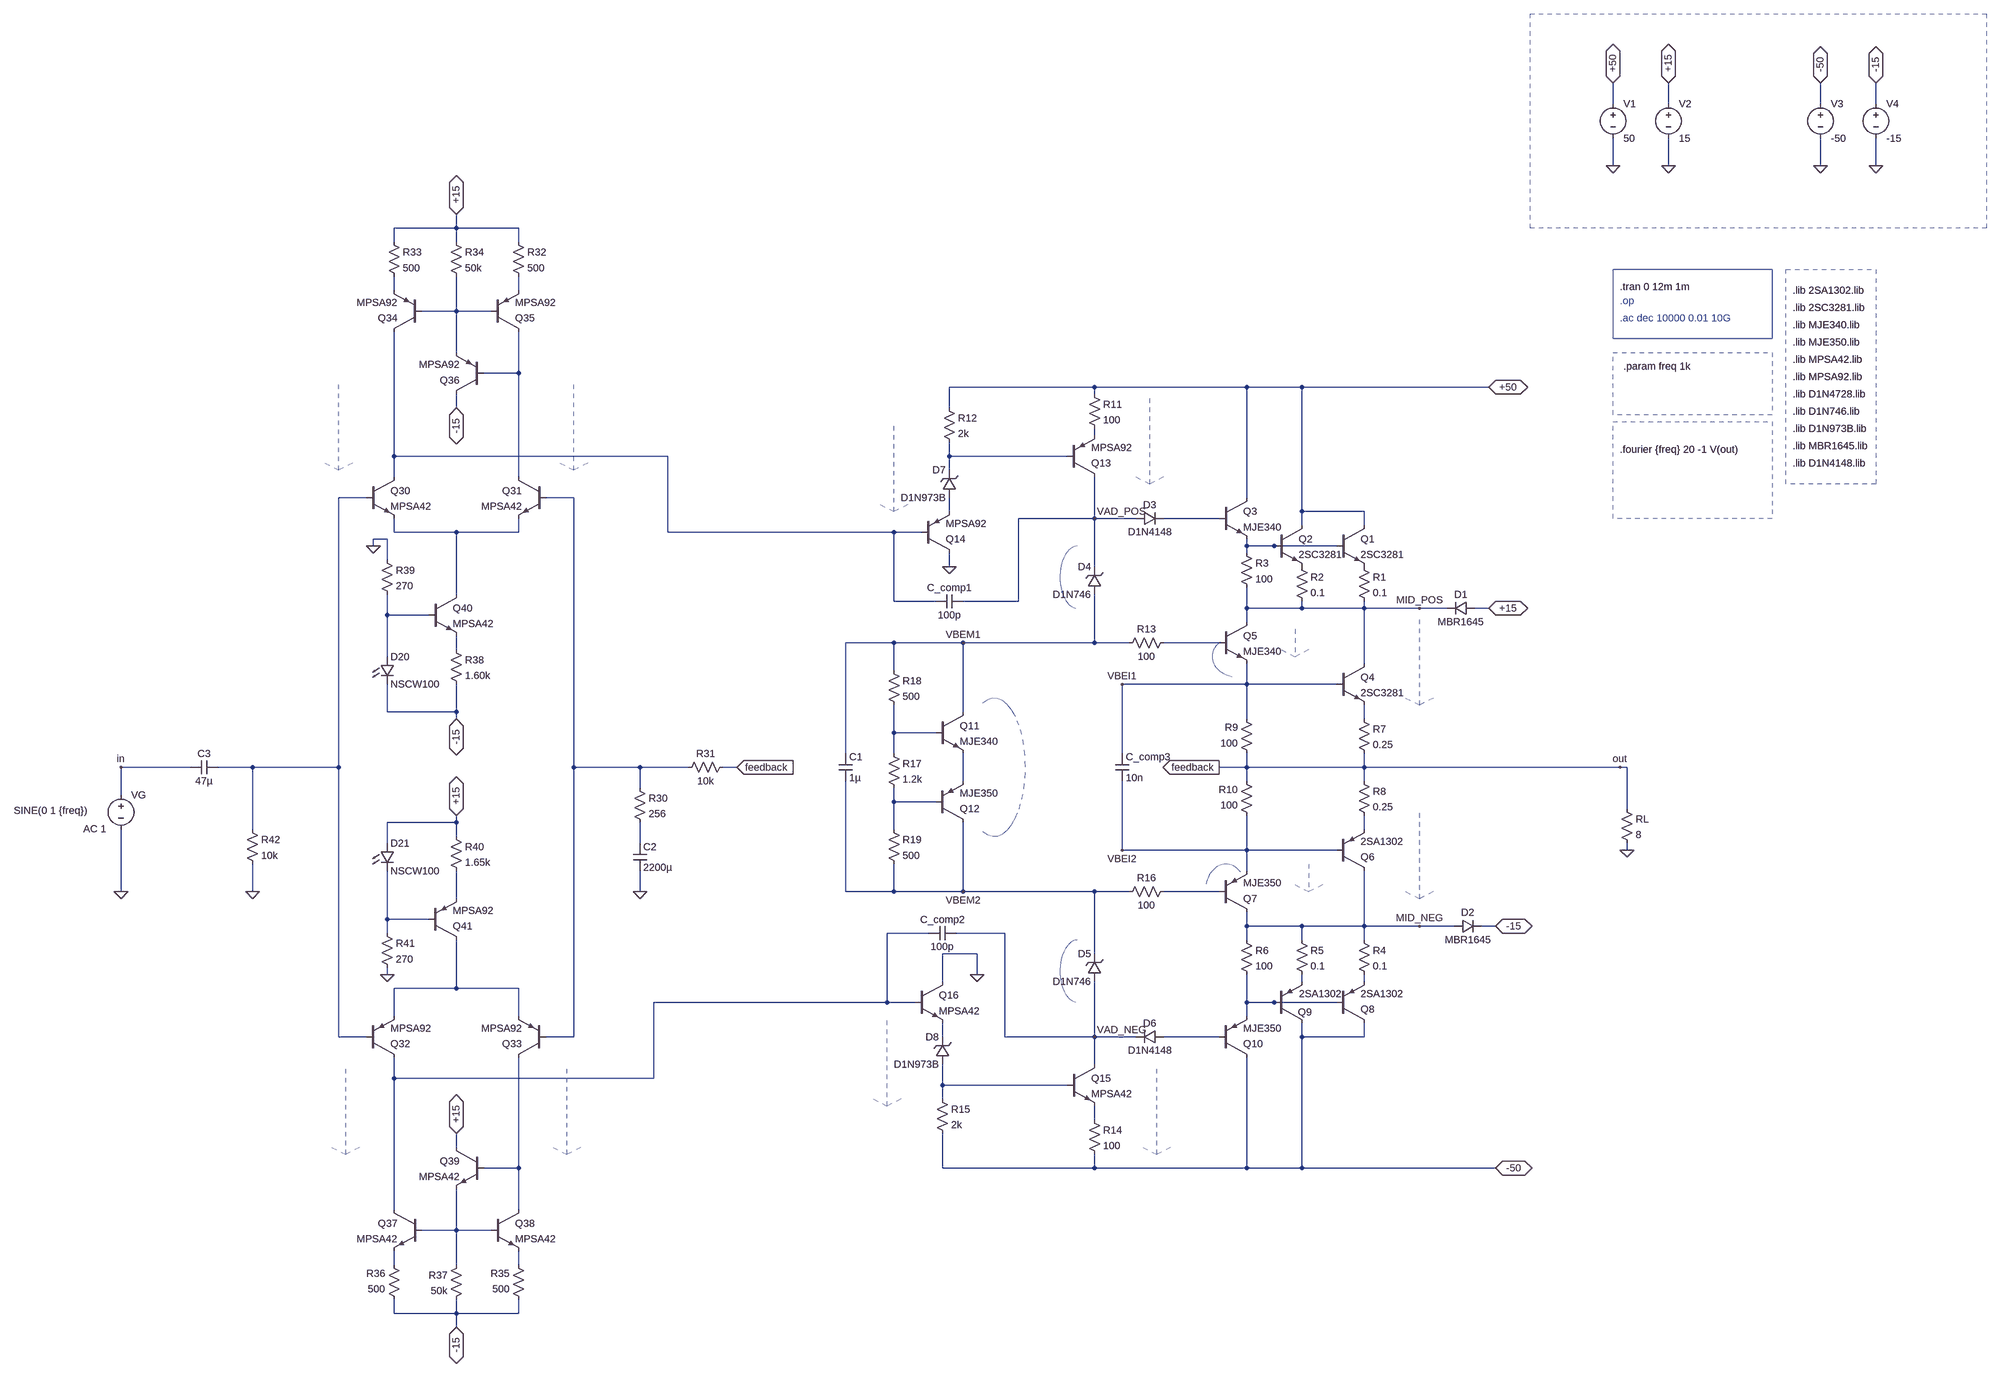
[diagram p0: schematic amplifier_V0.2.asc]
amplifier_V0.2.asc, the LTspice schematic file:
Version 4
SHEET 1 2916 1556
WIRE 896 -1408 896 -1456
WIRE 1024 -1408 1024 -1456
WIRE 1376 -1408 1376 -1456
WIRE 1504 -1408 1504 -1456
WIRE 896 -1264 896 -1328
WIRE 1024 -1264 1024 -1328
WIRE 1376 -1264 1376 -1328
WIRE 1504 -1264 1504 -1328
WIRE -2016 -1120 -2016 -1152
WIRE -2016 -1120 -2160 -1120
WIRE -1872 -1120 -2016 -1120
WIRE -2160 -1088 -2160 -1120
WIRE -2016 -1088 -2016 -1120
WIRE -1872 -1088 -1872 -1120
WIRE -2160 -976 -2160 -1008
WIRE -1872 -976 -1872 -1008
WIRE -2016 -928 -2016 -1008
WIRE -2016 -928 -2096 -928
WIRE -1936 -928 -2016 -928
WIRE -2016 -832 -2016 -928
WIRE -1872 -784 -1872 -880
WIRE -1872 -784 -1952 -784
WIRE -304 -752 -640 -752
WIRE 48 -752 -304 -752
WIRE 176 -752 48 -752
WIRE 608 -752 176 -752
WIRE -304 -736 -304 -752
WIRE -2016 -704 -2016 -736
WIRE -640 -704 -640 -752
WIRE -304 -640 -304 -656
WIRE -2160 -592 -2160 -880
WIRE -1472 -592 -2160 -592
WIRE -640 -592 -640 -624
WIRE -368 -592 -640 -592
WIRE -640 -560 -640 -592
WIRE -2160 -544 -2160 -592
WIRE -1872 -544 -1872 -784
WIRE -2224 -496 -2288 -496
WIRE -1744 -496 -1808 -496
WIRE 48 -496 48 -752
WIRE -640 -464 -640 -496
WIRE 176 -464 176 -752
WIRE 320 -464 176 -464
WIRE -304 -448 -304 -544
WIRE -304 -448 -480 -448
WIRE -208 -448 -304 -448
WIRE -16 -448 -144 -448
WIRE 176 -432 176 -464
WIRE 320 -432 320 -464
WIRE -2160 -416 -2160 -448
WIRE -2016 -416 -2160 -416
WIRE -1872 -416 -1872 -448
WIRE -1872 -416 -2016 -416
WIRE -1472 -416 -1472 -592
WIRE -768 -416 -1472 -416
WIRE -704 -416 -768 -416
WIRE -2176 -400 -2208 -400
WIRE -2208 -384 -2208 -400
WIRE 48 -384 48 -400
WIRE 112 -384 48 -384
WIRE 256 -384 112 -384
WIRE 48 -368 48 -384
WIRE -2176 -352 -2176 -400
WIRE -640 -336 -640 -368
WIRE -304 -336 -304 -448
WIRE -2016 -272 -2016 -416
WIRE -768 -256 -768 -416
WIRE -672 -256 -768 -256
WIRE -480 -256 -480 -448
WIRE -480 -256 -608 -256
WIRE 48 -240 48 -288
WIRE 176 -240 176 -256
WIRE 176 -240 48 -240
WIRE 320 -240 320 -256
WIRE 320 -240 176 -240
WIRE 448 -240 320 -240
WIRE 512 -240 448 -240
WIRE 608 -240 576 -240
WIRE -2176 -224 -2176 -272
WIRE -2080 -224 -2176 -224
WIRE 48 -208 48 -240
WIRE -768 -160 -880 -160
WIRE -608 -160 -768 -160
WIRE -304 -160 -304 -272
WIRE -304 -160 -608 -160
WIRE -224 -160 -304 -160
WIRE -16 -160 -144 -160
WIRE -2016 -144 -2016 -176
WIRE -2176 -128 -2176 -224
WIRE 320 -112 320 -240
WIRE -768 -96 -768 -160
WIRE 48 -64 48 -112
WIRE 48 -64 -240 -64
WIRE 256 -64 48 -64
WIRE -2176 0 -2176 -64
WIRE -2016 0 -2016 -64
WIRE -2016 0 -2176 0
WIRE -608 0 -608 -160
WIRE -2016 16 -2016 0
WIRE 48 16 48 -64
WIRE 320 16 320 -16
WIRE -768 48 -768 -16
WIRE -672 48 -768 48
WIRE -880 96 -880 -160
WIRE -768 96 -768 48
WIRE -240 96 -240 -64
WIRE -2640 128 -2912 128
WIRE -2496 128 -2576 128
WIRE -2288 128 -2288 -496
WIRE -2288 128 -2496 128
WIRE -1744 128 -1744 -496
WIRE -1536 128 -1744 128
WIRE -1424 128 -1536 128
WIRE -1312 128 -1344 128
WIRE 48 128 48 96
WIRE 48 128 -16 128
WIRE 320 128 320 96
WIRE 320 128 48 128
WIRE 912 128 320 128
WIRE 928 128 912 128
WIRE -608 160 -608 96
WIRE 48 160 48 128
WIRE 320 160 320 128
WIRE -1536 176 -1536 128
WIRE -2912 192 -2912 128
WIRE -768 208 -768 176
WIRE -672 208 -768 208
WIRE 928 224 928 128
WIRE -2016 256 -2016 240
WIRE -2016 256 -2176 256
WIRE -2496 272 -2496 128
WIRE -768 272 -768 208
WIRE 320 272 320 240
WIRE -2016 288 -2016 256
WIRE -2176 304 -2176 256
WIRE -1536 304 -1536 256
WIRE -240 320 -240 160
WIRE 48 320 48 240
WIRE 48 320 -240 320
WIRE 256 320 48 320
WIRE 928 320 928 304
WIRE 48 368 48 320
WIRE -2912 416 -2912 272
WIRE -2496 416 -2496 352
WIRE -1536 416 -1536 368
WIRE -880 416 -880 160
WIRE -768 416 -768 352
WIRE -768 416 -880 416
WIRE -608 416 -608 256
WIRE -608 416 -768 416
WIRE -304 416 -608 416
WIRE -224 416 -304 416
WIRE -16 416 -144 416
WIRE -2016 432 -2016 368
WIRE -2176 480 -2176 368
WIRE -2080 480 -2176 480
WIRE 48 496 48 464
WIRE 176 496 48 496
WIRE 320 496 320 368
WIRE 320 496 176 496
WIRE 448 496 320 496
WIRE 528 496 448 496
WIRE 624 496 592 496
WIRE -2176 512 -2176 480
WIRE -688 512 -784 512
WIRE -512 512 -624 512
WIRE 48 528 48 496
WIRE 176 528 176 496
WIRE 320 528 320 496
WIRE -576 560 -656 560
WIRE -304 560 -304 416
WIRE -2176 608 -2176 592
WIRE -576 608 -576 560
WIRE -656 624 -656 560
WIRE 176 624 176 608
WIRE 320 624 320 608
WIRE -2016 640 -2016 528
WIRE -2016 640 -2160 640
WIRE -1872 640 -2016 640
WIRE -784 672 -784 512
WIRE -784 672 -1504 672
WIRE -720 672 -784 672
WIRE 48 672 48 608
WIRE 112 672 48 672
WIRE 256 672 112 672
WIRE -2160 704 -2160 640
WIRE -1872 704 -1872 640
WIRE 48 704 48 672
WIRE -2288 752 -2288 128
WIRE -2224 752 -2288 752
WIRE -1744 752 -1744 128
WIRE -1744 752 -1808 752
WIRE -656 752 -656 720
WIRE -512 752 -512 512
WIRE -304 752 -304 624
WIRE -304 752 -512 752
WIRE -208 752 -304 752
WIRE -16 752 -144 752
WIRE 176 752 176 720
WIRE 320 752 320 720
WIRE 320 752 176 752
WIRE -304 816 -304 752
WIRE -2160 848 -2160 800
WIRE -1504 848 -1504 672
WIRE -1504 848 -2160 848
WIRE -656 864 -656 816
WIRE -368 864 -656 864
WIRE -656 896 -656 864
WIRE -304 944 -304 912
WIRE -2016 1008 -2016 976
WIRE -1872 1056 -1872 800
WIRE -1872 1056 -1952 1056
WIRE -656 1056 -656 976
WIRE -304 1056 -304 1024
WIRE -304 1056 -656 1056
WIRE 48 1056 48 800
WIRE 48 1056 -304 1056
WIRE 176 1056 176 752
WIRE 176 1056 48 1056
WIRE 624 1056 176 1056
WIRE -2160 1152 -2160 848
WIRE -1872 1152 -1872 1056
WIRE -2016 1200 -2016 1104
WIRE -2016 1200 -2096 1200
WIRE -1936 1200 -2016 1200
WIRE -2160 1280 -2160 1248
WIRE -2016 1280 -2016 1200
WIRE -1872 1280 -1872 1248
WIRE -2160 1392 -2160 1360
WIRE -2016 1392 -2016 1360
WIRE -2016 1392 -2160 1392
WIRE -1872 1392 -1872 1360
WIRE -1872 1392 -2016 1392
WIRE -2016 1424 -2016 1392
FLAG 624 1056 -50
IOPIN 624 1056 BiDir
FLAG 624 496 -15
IOPIN 624 496 BiDir
FLAG 608 -752 +50
IOPIN 608 -752 BiDir
FLAG 608 -240 +15
IOPIN 608 -240 BiDir
FLAG 928 320 0
FLAG 896 -1264 0
FLAG 1024 -1264 0
FLAG 1376 -1264 0
FLAG 1504 -1264 0
FLAG 896 -1456 +50
IOPIN 896 -1456 BiDir
FLAG 1024 -1456 +15
IOPIN 1024 -1456 BiDir
FLAG 1376 -1456 -50
IOPIN 1376 -1456 BiDir
FLAG 1504 -1456 -15
IOPIN 1504 -1456 BiDir
FLAG -608 -160 VBEM1
FLAG -608 416 VBEM2
FLAG 912 128 out
FLAG -304 -448 VAD_POS
FLAG -304 752 VAD_NEG
FLAG 448 496 MID_NEG
FLAG 448 -240 MID_POS
FLAG -240 -64 VBEI1
FLAG -240 320 VBEI2
FLAG -2176 608 0
FLAG -2208 -384 0
FLAG -2496 416 0
FLAG -1536 416 0
FLAG -2912 416 0
FLAG -640 -336 0
FLAG -576 608 0
FLAG -2016 16 -15
IOPIN -2016 16 BiDir
FLAG -2016 240 +15
IOPIN -2016 240 BiDir
FLAG -2016 -1152 +15
IOPIN -2016 -1152 BiDir
FLAG -2016 1424 -15
IOPIN -2016 1424 BiDir
FLAG -2016 976 +15
IOPIN -2016 976 BiDir
FLAG -2016 -704 -15
IOPIN -2016 -704 BiDir
FLAG -2912 128 in
FLAG -16 128 feedback
IOPIN -16 128 Out
FLAG -1312 128 feedback
IOPIN -1312 128 In
DATAFLAG 96 496 "round($*100)/100"
DATAFLAG 816 128 ""
DATAFLAG 448 -96 "Ic(Q4)"
DATAFLAG 448 352 "-Ic(Q6)"
DATAFLAG -464 128 "V(vbem1)-V(vbem2)"
DATAFLAG 160 -160 "-Ie(Q5)"
DATAFLAG 192 384 "Ie(Q7)"
DATAFLAG -608 -80 "Ic(Q13)"
DATAFLAG -608 336 "Ic(Q12)"
DATAFLAG -384 -304 "V(vad_pos)-V(vbem1)"
DATAFLAG -384 608 "-(V(vad_neg)-V(vbem2))"
DATAFLAG -16 -96 "V(vbem1)-V(vbei1)"
DATAFLAG -32 368 "-(V(vbem2)-V(vbei2))"
DATAFLAG -448 416 ""
DATAFLAG -464 -160 ""
DATAFLAG -176 -624 "-Ic(Q13)"
DATAFLAG -160 928 "Ic(Q15)"
DATAFLAG -768 -560 "Ie(Q14)"
DATAFLAG -480 864 ""
DATAFLAG -784 800 "-Ie(Q16)"
DATAFLAG -928 -416 ""
DATAFLAG -1040 672 ""
DATAFLAG -416 -448 ""
DATAFLAG -1744 -656 "Ic(Q31)"
DATAFLAG -2288 -656 "Ic(Q30)"
DATAFLAG -2016 -416 ""
DATAFLAG -2272 928 "-Ic(Q32)"
DATAFLAG -2016 640 ""
DATAFLAG -2160 960 ""
DATAFLAG -1760 928 "-Ic(Q33)"
DATAFLAG -1872 976 ""
DATAFLAG -2160 -672 ""
DATAFLAG -1872 -672 ""
DATAFLAG -1920 -336 "Ic(Q40)"
DATAFLAG -1888 576 "-Ic(Q41)"
SYMBOL npn 112 -432 R0
SYMATTR InstName Q2
SYMATTR Value 2SC3281
SYMBOL npn -16 -496 R0
SYMATTR InstName Q3
SYMATTR Value MJE340
SYMBOL res 32 -384 R0
SYMATTR InstName R3
SYMATTR Value 100
SYMBOL diode -208 -432 R270
WINDOW 0 32 32 VTop 2
WINDOW 3 0 32 VBottom 2
SYMATTR InstName D3
SYMATTR Value D1N4148
SYMBOL zener -288 -272 R180
WINDOW 0 24 64 Left 2
WINDOW 3 24 0 Left 2
SYMATTR InstName D4
SYMATTR Value D1N746
SYMBOL npn -16 -208 R0
SYMATTR InstName Q5
SYMATTR Value MJE340
SYMBOL npn 256 -112 R0
SYMATTR InstName Q4
SYMATTR Value 2SC3281
SYMBOL res 304 0 R0
SYMATTR InstName R7
SYMATTR Value 0.25
SYMBOL res 64 112 R180
WINDOW 0 36 76 Left 2
WINDOW 3 36 40 Left 2
SYMATTR InstName R9
SYMATTR Value 100
SYMBOL res 304 144 R0
SYMATTR InstName R8
SYMATTR Value 0.25
SYMBOL pnp 256 368 M180
SYMATTR InstName Q6
SYMATTR Value 2SA1302
SYMBOL pnp -16 464 M180
SYMATTR InstName Q7
SYMATTR Value MJE350
SYMBOL pnp 112 720 M180
WINDOW 0 55 25 Left 2
WINDOW 3 57 68 Left 2
SYMATTR InstName Q9
SYMATTR Value 2SA1302
SYMBOL pnp -16 800 M180
SYMATTR InstName Q10
SYMATTR Value MJE350
SYMBOL res 32 512 R0
SYMATTR InstName R6
SYMATTR Value 100
SYMBOL zener -288 624 R180
WINDOW 0 24 64 Left 2
WINDOW 3 24 0 Left 2
SYMATTR InstName D5
SYMATTR Value D1N746
SYMBOL diode -144 736 R90
WINDOW 0 0 32 VBottom 2
WINDOW 3 32 32 VTop 2
SYMATTR InstName D6
SYMATTR Value D1N4148
SYMBOL diode 528 512 R270
WINDOW 0 32 32 VTop 2
WINDOW 3 0 32 VBottom 2
SYMATTR InstName D2
SYMATTR Value MBR1645
SYMBOL res 64 256 R180
WINDOW 0 36 76 Left 2
WINDOW 3 36 40 Left 2
SYMATTR InstName R10
SYMATTR Value 100
SYMBOL npn 256 -432 R0
SYMATTR InstName Q1
SYMATTR Value 2SC3281
SYMBOL pnp 256 720 M180
SYMATTR InstName Q8
SYMATTR Value 2SA1302
SYMBOL res 304 512 R0
SYMATTR InstName R4
SYMATTR Value 0.1
SYMBOL res 160 512 R0
SYMATTR InstName R5
SYMATTR Value 0.1
SYMBOL res 160 -352 R0
SYMATTR InstName R2
SYMATTR Value 0.1
SYMBOL res 304 -352 R0
SYMATTR InstName R1
SYMATTR Value 0.1
SYMBOL res 912 208 R0
SYMATTR InstName RL
SYMATTR Value 8
SYMBOL diode 576 -224 M270
WINDOW 0 32 32 VTop 2
WINDOW 3 0 32 VBottom 2
SYMATTR InstName D1
SYMATTR Value MBR1645
SYMBOL voltage 896 -1424 R0
SYMATTR InstName V1
SYMATTR Value 50
SYMBOL voltage 1024 -1424 R0
SYMATTR InstName V2
SYMATTR Value 15
SYMBOL voltage 1376 -1424 R0
SYMATTR InstName V3
SYMATTR Value -50
SYMBOL voltage 1504 -1424 R0
SYMATTR InstName V4
SYMATTR Value -15
SYMBOL pnp -672 256 M180
SYMATTR InstName Q12
SYMATTR Value MJE350
SYMBOL npn -672 0 R0
SYMATTR InstName Q11
SYMATTR Value MJE340
SYMBOL res -784 80 R0
SYMATTR InstName R17
SYMATTR Value 1.2k
SYMBOL res -784 -112 R0
SYMATTR InstName R18
SYMATTR Value 500
SYMBOL res -784 256 R0
SYMATTR InstName R19
SYMATTR Value 500
SYMBOL cap -256 96 R0
SYMATTR InstName C_comp3
SYMATTR Value 10n
SYMBOL res -128 -176 R90
WINDOW 0 0 56 VBottom 2
WINDOW 3 32 56 VTop 2
SYMATTR InstName R13
SYMATTR Value 100
SYMBOL res -128 400 R90
WINDOW 0 0 56 VBottom 2
WINDOW 3 32 56 VTop 2
SYMATTR InstName R16
SYMATTR Value 100
SYMBOL pnp -368 -544 M180
SYMATTR InstName Q13
SYMATTR Value MPSA92
SYMBOL npn -368 816 R0
SYMATTR InstName Q15
SYMATTR Value MPSA42
SYMBOL cap -896 96 R0
SYMATTR InstName C1
SYMATTR Value 1µ
SYMBOL voltage -2912 176 R0
WINDOW 3 -248 52 Left 2
WINDOW 123 -87 95 Left 2
WINDOW 39 0 0 Left 2
SYMATTR Value SINE(0 1 {freq})
SYMATTR Value2 AC 1
SYMATTR InstName VG
SYMBOL npn -720 624 R0
SYMATTR InstName Q16
SYMATTR Value MPSA42
SYMBOL res -672 880 R0
SYMATTR InstName R15
SYMATTR Value 2k
SYMBOL res -1552 160 R0
SYMATTR InstName R30
SYMATTR Value 256
SYMBOL res -1328 112 R90
WINDOW 0 0 56 VBottom 2
WINDOW 3 32 56 VTop 2
SYMATTR InstName R31
SYMATTR Value 10k
SYMBOL res -2512 256 R0
SYMATTR InstName R42
SYMATTR Value 10k
SYMBOL cap -1552 304 R0
SYMATTR InstName C2
SYMATTR Value 2200µ
SYMBOL cap -2576 112 R90
WINDOW 0 0 32 VBottom 2
WINDOW 3 32 32 VTop 2
SYMATTR InstName C3
SYMATTR Value 47µ
SYMBOL pnp -704 -368 M180
SYMATTR InstName Q14
SYMATTR Value MPSA92
SYMBOL res -656 -720 R0
SYMATTR InstName R12
SYMATTR Value 2k
SYMBOL zener -640 816 R180
WINDOW 0 24 64 Left 2
WINDOW 3 24 0 Left 2
SYMATTR InstName D8
SYMATTR Value D1N973B
SYMBOL zener -624 -496 R180
WINDOW 0 24 64 Left 2
WINDOW 3 24 0 Left 2
SYMATTR InstName D7
SYMATTR Value D1N973B
SYMBOL npn -2080 -272 R0
SYMATTR InstName Q40
SYMATTR Value MPSA42
SYMBOL npn -2224 -544 R0
SYMATTR InstName Q30
SYMATTR Value MPSA42
SYMBOL npn -1808 -544 M0
SYMATTR InstName Q31
SYMATTR Value MPSA42
SYMBOL res -2192 -368 R0
SYMATTR InstName R39
SYMATTR Value 270
SYMBOL res -2032 -160 R0
SYMATTR InstName R38
SYMATTR Value 1.60k
SYMBOL LED -2192 -128 R0
SYMATTR InstName D20
SYMATTR Value NSCW100
SYMBOL res -2032 272 R0
SYMATTR InstName R40
SYMATTR Value 1.65k
SYMBOL pnp -2080 528 M180
SYMATTR InstName Q41
SYMATTR Value MPSA92
SYMBOL pnp -2224 800 M180
SYMATTR InstName Q32
SYMATTR Value MPSA92
SYMBOL pnp -1808 800 R180
SYMATTR InstName Q33
SYMATTR Value MPSA92
SYMBOL LED -2192 304 R0
SYMATTR InstName D21
SYMATTR Value NSCW100
SYMBOL res -2192 496 R0
SYMATTR InstName R41
SYMATTR Value 270
SYMBOL cap -608 -272 R90
WINDOW 0 0 32 VBottom 2
WINDOW 3 32 32 VTop 2
SYMATTR InstName C_comp1
SYMATTR Value 100p
SYMBOL cap -624 496 R90
WINDOW 0 0 32 VBottom 2
WINDOW 3 32 32 VTop 2
SYMATTR InstName C_comp2
SYMATTR Value 100p
SYMBOL pnp -1936 -880 M180
SYMATTR InstName Q35
SYMATTR Value MPSA92
SYMBOL pnp -2096 -880 R180
SYMATTR InstName Q34
SYMATTR Value MPSA92
SYMBOL npn -2096 1152 M0
SYMATTR InstName Q37
SYMATTR Value MPSA42
SYMBOL npn -1936 1152 R0
SYMATTR InstName Q38
SYMATTR Value MPSA42
SYMBOL res -320 -752 R0
SYMATTR InstName R11
SYMATTR Value 100
SYMBOL res -320 928 R0
SYMATTR InstName R14
SYMATTR Value 100
SYMBOL res -2176 -1104 R0
SYMATTR InstName R33
SYMATTR Value 500
SYMBOL res -1888 -1104 R0
SYMATTR InstName R32
SYMATTR Value 500
SYMBOL res -1856 1376 R180
WINDOW 0 36 76 Left 2
WINDOW 3 36 40 Left 2
SYMATTR InstName R35
SYMATTR Value 500
SYMBOL res -2144 1376 R180
WINDOW 0 36 76 Left 2
WINDOW 3 36 40 Left 2
SYMATTR InstName R36
SYMATTR Value 500
SYMBOL npn -1952 1008 M0
SYMATTR InstName Q39
SYMATTR Value MPSA42
SYMBOL pnp -1952 -736 R180
SYMATTR InstName Q36
SYMATTR Value MPSA92
SYMBOL res -2000 1264 M0
SYMATTR InstName R37
SYMATTR Value 50k
SYMBOL res -2032 -1104 R0
SYMATTR InstName R34
SYMATTR Value 50k
TEXT 912 -984 Left 2 !.tran 0 12m 1m
TEXT 920 -800 Left 2 !.param freq 1k
TEXT 912 -952 Left 2 ;.op
TEXT 912 -608 Left 2 !.fourier {freq} 20 -1 V(out)
TEXT 1312 -976 Left 2 !.lib 2SA1302.lib
TEXT 1312 -936 Left 2 !.lib 2SC3281.lib
TEXT 1312 -736 Left 2 !.lib D1N4728.lib
TEXT 1312 -616 Left 2 !.lib MBR1645.lib
TEXT 1312 -896 Left 2 !.lib MJE340.lib
TEXT 1312 -856 Left 2 !.lib MJE350.lib
TEXT 1312 -576 Left 2 !.lib D1N4148.lib
TEXT 1312 -816 Left 2 !.lib MPSA42.lib
TEXT 1312 -776 Left 2 !.lib MPSA92.lib
TEXT 1312 -696 Left 2 !.lib D1N746.lib
TEXT 1312 -656 Left 2 !.lib D1N973B.lib
TEXT 912 -912 Left 2 ;.ac dec 10000 0.01 10G
LINE Normal -768 -464 -768 -672 2
LINE Normal -736 -480 -768 -464 2
LINE Normal -800 -480 -768 -464 2
LINE Normal -784 912 -784 704 2
LINE Normal -752 896 -784 912 2
LINE Normal -816 896 -784 912 2
LINE Normal 448 -16 448 -224 2
LINE Normal 480 -32 448 -16 2
LINE Normal 416 -32 448 -16 2
LINE Normal 448 432 448 224 2
LINE Normal 480 416 448 432 2
LINE Normal 416 416 448 432 2
LINE Normal -176 -528 -176 -736 2
LINE Normal -144 -544 -176 -528 2
LINE Normal -208 -544 -176 -528 2
LINE Normal -160 1024 -160 816 2
LINE Normal -128 1008 -160 1024 2
LINE Normal -192 1008 -160 1024 2
LINE Normal 192 -144 160 -128 2
LINE Normal 128 -144 160 -128 2
LINE Normal 160 -192 160 -128 2
LINE Normal 224 400 192 416 2
LINE Normal 160 400 192 416 2
LINE Normal 192 352 192 416 2
LINE Normal -1744 -560 -1744 -768 2
LINE Normal -1712 -576 -1744 -560 2
LINE Normal -1776 -576 -1744 -560 2
LINE Normal -2288 -560 -2288 -768 2
LINE Normal -2256 -576 -2288 -560 2
LINE Normal -2320 -576 -2288 -560 2
LINE Normal -2272 1024 -2272 816 2
LINE Normal -2240 1008 -2272 1024 2
LINE Normal -2304 1008 -2272 1024 2
LINE Normal -1760 1024 -1760 816 2
LINE Normal -1728 1008 -1760 1024 2
LINE Normal -1792 1008 -1760 1024 2
RECTANGLE Normal 1504 -528 1296 -1024 2
RECTANGLE Normal 1264 -864 896 -1024
RECTANGLE Normal 1264 -688 896 -832 3
RECTANGLE Normal 1264 -448 896 -672 4
RECTANGLE Normal 1760 -1120 704 -1616 4
ARC Normal -32 -176 96 -80 -29 -174 0 -45 3
ARC Normal 48 352 -48 480 46 355 -83 384 3
ARC Normal -608 -32 -464 288 -563 277 -565 -27 2
ARC Normal -304 528 -384 672 -344 520 -348 678 2
ARC Normal -304 -384 -384 -240 -344 -392 -348 -234 2

The netlist it stands for:
* amplifier_V0.2.asc
Q2 +50 N013 P001 0 2SC3281
Q3 +50 N011 N013 0 MJE340
R3 N013 MID_POS 100
D3 VAD_POS N011 D1N4148
D4 VBEM1 VAD_POS D1N746
Q5 MID_POS N015 VBEI1 0 MJE340
Q4 MID_POS VBEI1 N017 0 2SC3281
R7 N017 feedback 0.25
R9 feedback VBEI1 100
R8 feedback N021 0.25
Q6 MID_NEG VBEI2 N021 0 2SA1302
Q7 MID_NEG N023 VBEI2 0 MJE350
Q9 -50 N030 N027 0 2SA1302
Q10 -50 N032 N030 0 MJE350
R6 MID_NEG N030 100
D5 VAD_NEG VBEM2 D1N746
D6 N032 VAD_NEG D1N4148
D2 MID_NEG -15 MBR1645
R10 VBEI2 feedback 100
Q1 +50 N013 P002 0 2SC3281
Q8 -50 N030 N028 0 2SA1302
R4 MID_NEG N028 0.1
R5 MID_NEG N027 0.1
R2 P001 MID_POS 0.1
R1 P002 MID_POS 0.1
RL feedback 0 8
D1 +15 MID_POS MBR1645
V1 +50 0 50
V2 +15 0 15
V3 -50 0 -50
V4 -15 0 -15
Q12 VBEM2 N020 N019 0 MJE350
Q11 VBEM1 N018 N019 0 MJE340
R17 N018 N020 1.2k
R18 VBEM1 N018 500
R19 N020 VBEM2 500
C_comp3 VBEI1 VBEI2 10n
R13 N015 VBEM1 100
R16 N023 VBEM2 100
Q13 VAD_POS N007 N005 0 MPSA92
Q15 VAD_NEG N033 N034 0 MPSA42
C1 VBEM1 VBEM2 1µ
VG in 0 SINE(0 1 {freq}) AC 1
Q16 0 N026 N031 0 MPSA42
R15 N033 -50 2k
R30 N009 N022 256
R31 feedback N009 10k
R42 N008 0 10k
C2 N022 0 2200µ
C3 N008 in 47µ
Q14 0 N006 N010 0 MPSA92
R12 +50 N007 2k
D8 N033 N031 D1N973B
D7 N010 N007 D1N973B
Q40 N012 N014 N016 0 MPSA42
Q30 N006 N008 N012 0 MPSA42
Q31 N004 N009 N012 0 MPSA42
R39 0 N014 270
R38 N016 -15 1.60k
D20 N014 -15 NSCW100
R40 +15 N024 1.65k
Q41 N029 N025 N024 0 MPSA92
Q32 N026 N008 N029 0 MPSA92
Q33 N035 N009 N029 0 MPSA92
D21 +15 N025 NSCW100
R41 N025 0 270
C_comp1 VAD_POS N006 100p
C_comp2 VAD_NEG N026 100p
Q35 N004 N003 N002 0 MPSA92
Q34 N006 N003 N001 0 MPSA92
Q37 N026 N036 N037 0 MPSA42
Q38 N035 N036 N038 0 MPSA42
R11 +50 N005 100
R14 N034 -50 100
R33 +15 N001 500
R32 +15 N002 500
R35 -15 N038 500
R36 -15 N037 500
Q39 +15 N035 N036 0 MPSA42
Q36 -15 N004 N003 0 MPSA92
R37 N036 -15 50k
R34 +15 N003 50k
.model D D
.lib standard.dio
.model NPN NPN
.model PNP PNP
.lib standard.bjt
.tran 0 12m 1m
.param freq 1k
* .op
.fourier {freq} 20 -1 V(out)
.lib 2SA1302.lib
.lib 2SC3281.lib
.lib D1N4728.lib
.lib MBR1645.lib
.lib MJE340.lib
.lib MJE350.lib
.lib D1N4148.lib
.lib MPSA42.lib
.lib MPSA92.lib
.lib D1N746.lib
.lib D1N973B.lib
* .ac dec 10000 0.01 10G
.backanno
.end